# Altium schematic sheet FPGA_Bank_0_CFG.SchDoc: Sayma AMC
size 420 x 297 mm; $$Internal___BlkDate: 0:12:25_2-9-18; $$Internal_NAME_PLACEHOLDER: a3sheet; $$Internal_Resolution: 00001mm; $$NotCommonProperty_@NAME: FPGA_XCKU040FFVA1156; $$NotCommonProperty_@PRINTORDER: 15; $$NotCommonProperty_@SHEET: FPGA Bank 0 CFG; $$NotCommonProperty_@SHEETTOTAL: 30; CmpIndex: 969; Drawing Author: G.Kasprowicz; Drawing Number: Sayma AMC; Drawing Project: AMC FMC Carrier Board; Drawing Revision: 2.0; SymIndex: 2141; CheckedBy: P.Kulik,T.Przywozki,W.Ruclo; Author: G.Kasprowicz; CompanyName: WUT ISE; DrawnBy: G.Kasprowicz; Organization: WUT ISE; Address1: PW ISE; Address2: Nowowiejska 15/19 00-665 Warsaw; Address3: gkasprow@gmail.com; DocumentNumber: 21; Revision: 2; SheetNumber: 21; SheetTotal: 32; ModifiedBy: -; CheckedDate: -; Title2: FPGA config; DivGrp: WUT ISE; Designer: G.Kasprowicz; ModifiedDate: -; ProjectName: Sensor Box
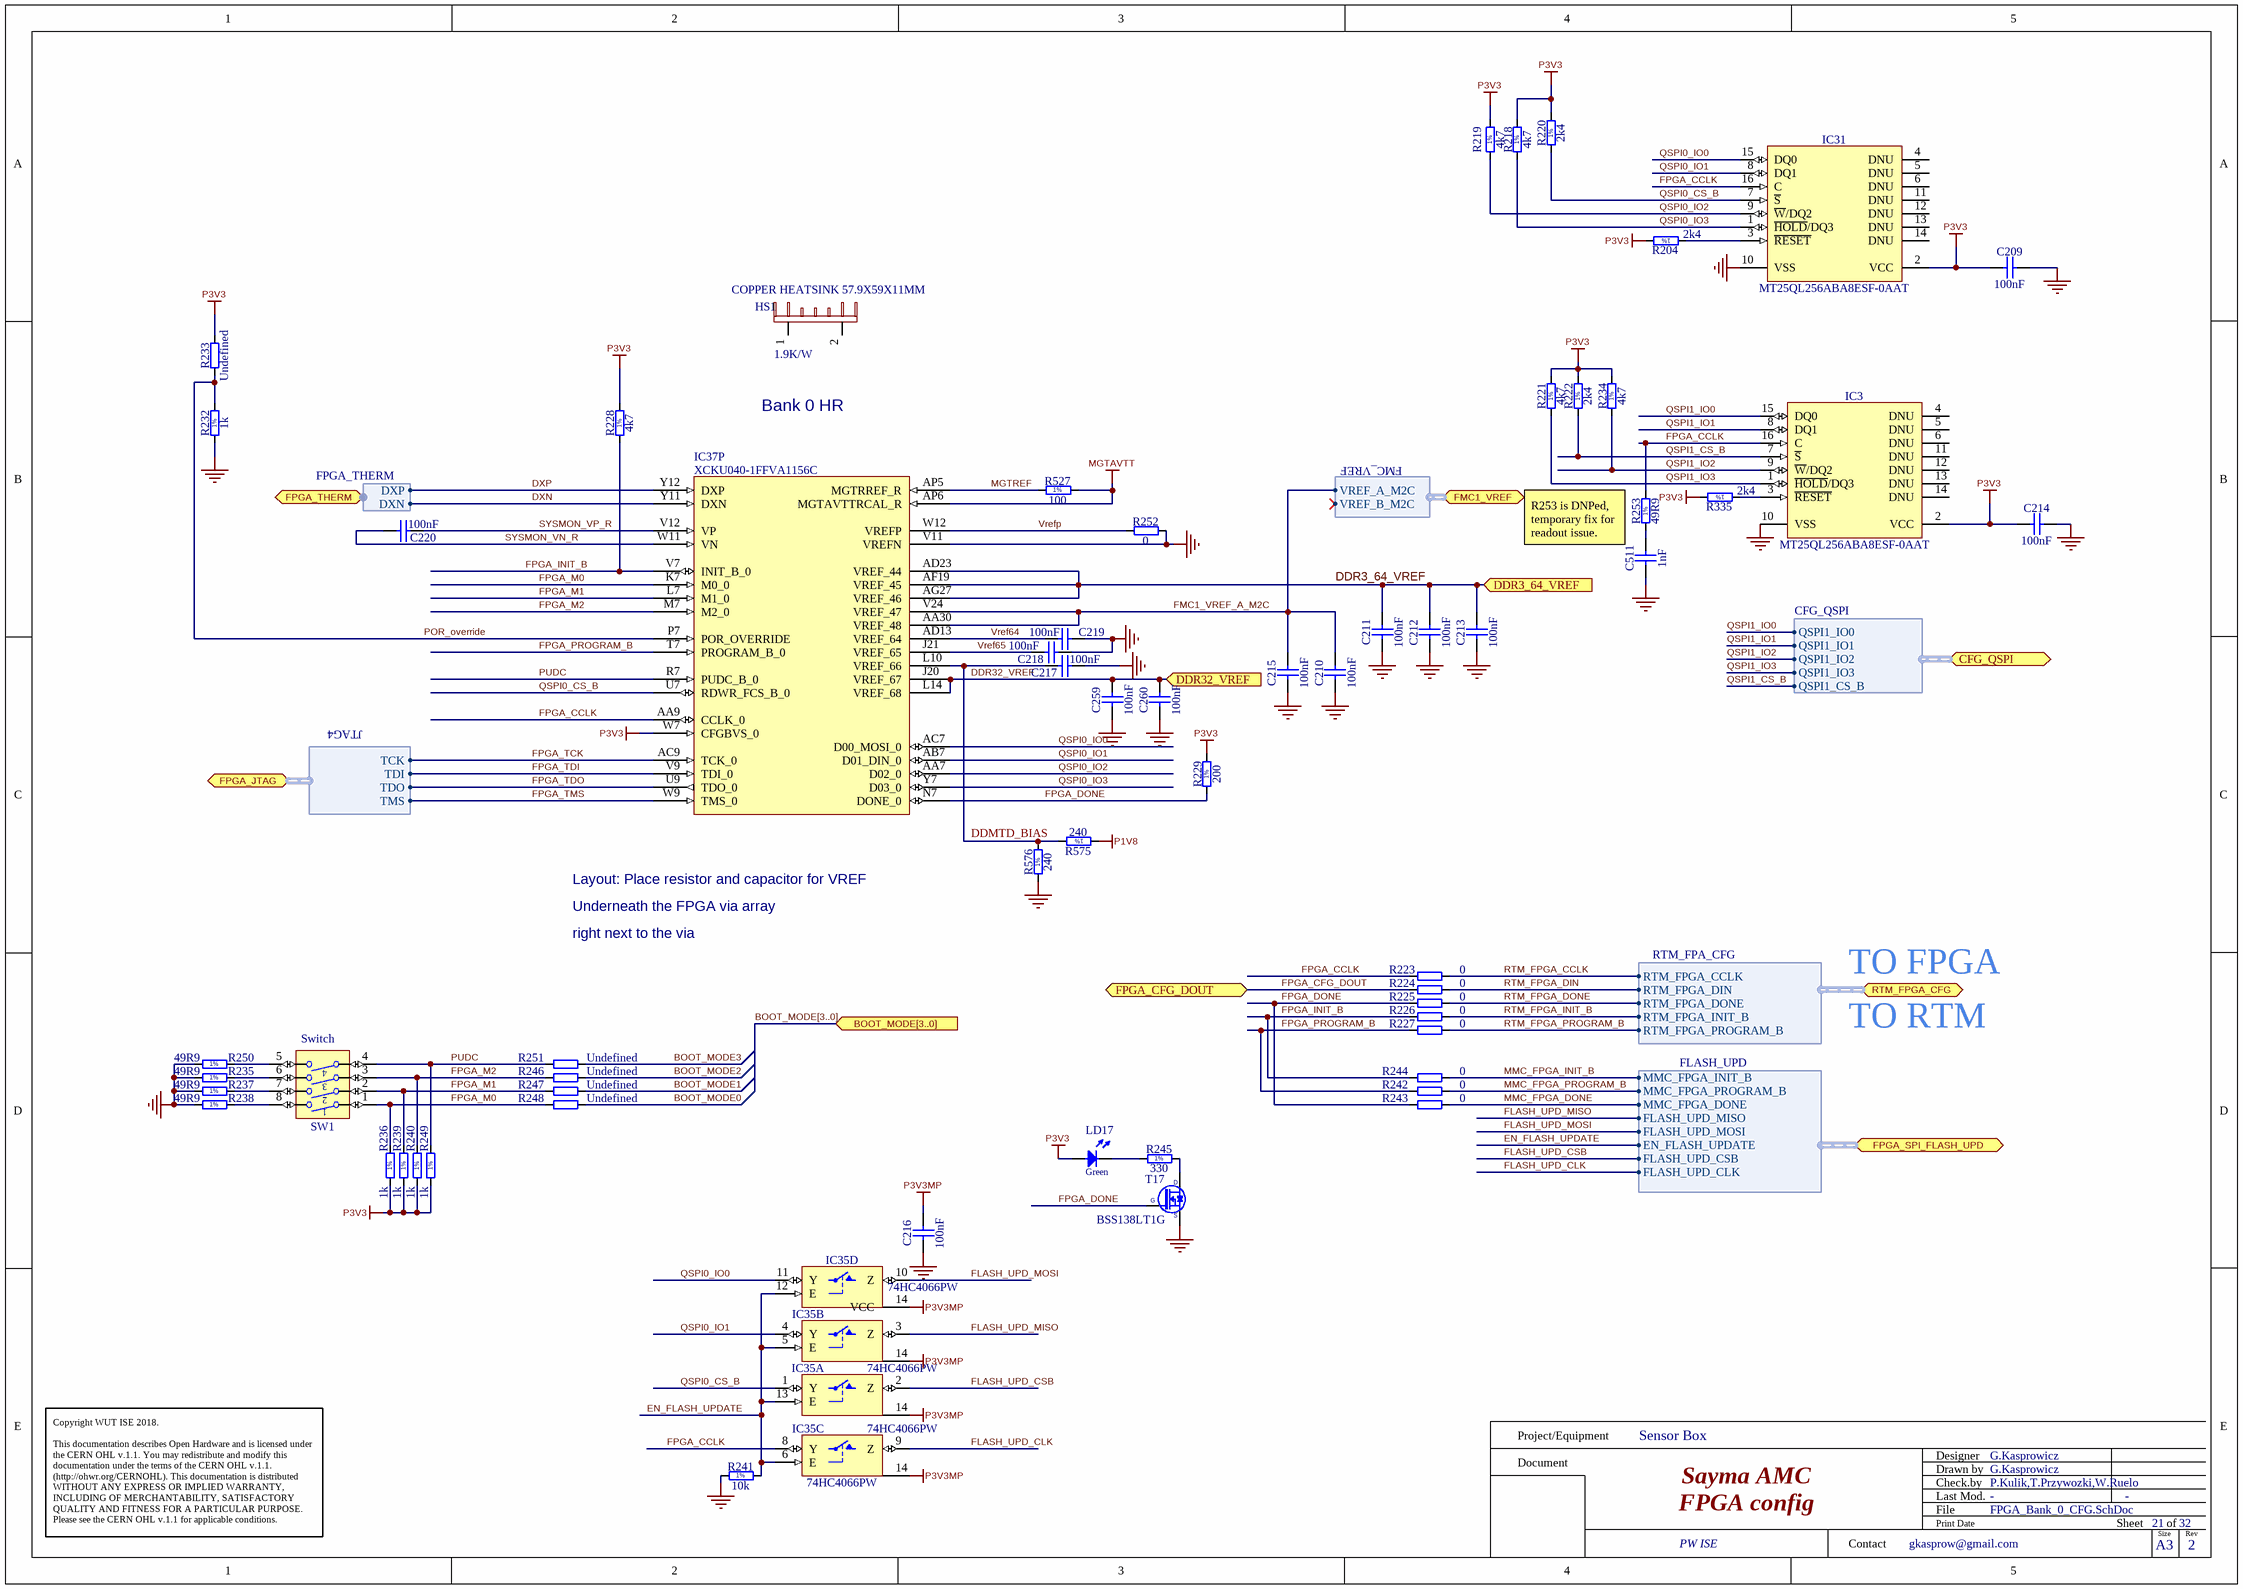
[diagram p0: FPGA_Bank_0_CFG.SchDoc]

## Parts
C209  100nF  [CAPC0603X33N]
C210  100nF  [CAPC0603X33N]
C211  100nF  [CAPC0603X33N]
C212  100nF  [CAPC0603X33N]
C213  100nF  [CAPC0603X33N]
C214  100nF  [CAPC0603X33N]
C215  100nF  [CAPC0603X33N]
C216  100nF  [CAPC0603X33N]
C217  100nF  [CAPC0603X33N]
C218  100nF  [CAPC0603X33N]
C219  100nF  [CAPC0603X33N]
C220  100nF  [CAPC0603X33N]
C259  100nF  [CAPC0603X33N]
C260  100nF  [CAPC0603X33N]
C511  1nF  [CAPC1005X55N]
HS1  1.9K/W  Part Description: COPPER HEATSINK 57.9X59X11MM  [HS_AAVID_342947]
IC3  MT25QL256ABA8ESF-0AAT  [SOIC127P1030X265-16N]
IC31  MT25QL256ABA8ESF-0AAT  [SOIC127P1030X265-16N]
IC35  74HC4066PW  [SOP65P640X110-14N]  (parts A,B,C,D of 4)
IC37  XCKU040-1FFVA1156C  [BGA1156C100P34X34_3500X3500X350]  (part P of 22)
LD17  Green  [LED_AVAGO_HSME-C120]
R204  2k4  [RESC1005X40N]
R218  4k7  [RESC1005X40N]
R219  4k7  [RESC1005X40N]
R220  2k4  [RESC1005X40N]
R221  4k7  [RESC1005X40N]
R222  2k4  [RESC1005X40N]
R223  0  [RESC1005X40N]
R224  0  [RESC1005X40N]
R225  0  [RESC1005X40N]
R226  0  [RESC1005X40N]
R227  0  [RESC1005X40N]
R228  4k7  [RESC1005X40N]
R229  200  [RESC1005X40N]
R232  1k  [RESC1005X40N]
R233  Undefined  [RESC1005X40N]
R234  4k7  [RESC1005X40N]
R235  49R9  [RESC1005X40N]
R236  1k  [RESC1005X40N]
R237  49R9  [RESC1005X40N]
R238  49R9  [RESC1005X40N]
R239  1k  [RESC1005X40N]
R240  1k  [RESC1005X40N]
R241  10k  [RESC1005X40N]
R242  0  [RESC1005X40N]
R243  0  [RESC1005X40N]
R244  0  [RESC1005X40N]
R245  330  [RESC1005X40N]
R246  Undefined  [RESC1005X40N]
R247  Undefined  [RESC1005X40N]
R248  Undefined  [RESC1005X40N]
R249  1k  [RESC1005X40N]
R250  49R9  [RESC1005X40N]
R251  Undefined  [RESC1005X40N]
R252  0  [RESC1005X40N]
R253  49R9  [RESC1005X40N]
R335  2k4  [RESC1005X40N]
R527  100  [RESC0603X28N]
R575  240  [RESC1005X40N]
R576  240  [RESC1005X40N]
SW1  Switch  [SW_TYCO_1571983-4]
T17  BSS138LT1G  [SOT95P240X110-3N]

## Ports
BOOT_MODE[3..0] (in), CFG_QSPI (bidir, harness CFG_QSPI), DDR3_64_VREF (in), DDR32_VREF (in), FMC1_VREF (bidir, harness FMC_VREF), FPGA_CFG_DOUT (bidir), FPGA_JTAG (bidir, harness JTAG4), FPGA_SPI_FLASH_UPD (bidir, harness FLASH_UPD), FPGA_THERM (bidir, harness FPGA_THERM), RTM_FPGA_CFG (bidir, harness RTM_FPA_CFG)

## Harnesses
CFG_QSPI: QSPI1_IO0, QSPI1_IO1, QSPI1_IO2, QSPI1_IO3, QSPI1_CS_B
FLASH_UPD: MMC_FPGA_PROGRAM_B, MMC_FPGA_DONE, EN_FLASH_UPDATE, MMC_FPGA_INIT_B, FLASH_UPD_CLK, FLASH_UPD_CSB, FLASH_UPD_MISO, FLASH_UPD_MOSI
FMC_VREF: VREF_A_M2C, VREF_B_M2C
RTM_FPA_CFG: RTM_FPGA_DIN, RTM_FPGA_CCLK, RTM_FPGA_PROGRAM_B, RTM_FPGA_DONE, RTM_FPGA_INIT_B
JTAG4: TCK, TDI, TDO, TMS
FPGA_THERM: DXP, DXN

## Nets
GND: C209.1 C210.2 C211.2 C212.2 C213.2 C214.1 C215.2 C216.1 C217.2 C218.2 C219.2 C259.2 C260.2 C511.1 IC3.10(VSS) IC31.10(VSS) IC35.7(GND) IC37.V11(VREFN) R232.1 R235.1 R237.1 R238.1 R241.1 R250.1 R252.2 R576.1 T17.2(S)
MGTAVTT: IC37.AP6(MGTAVTTRCAL_R) R527.2
P1V8: R575.1
P3V3: C209.2 C214.2 IC3.2(VCC) IC31.2(VCC) IC37.W7(CFGBVS_0) LD17.2(A) R204.2 R218.2 R219.2 R220.2 R221.2 R222.2 R228.2 R229.2 R233.2 R234.2 R236.1 R239.1 R240.1 R249.1 R335.2
P3V3MP: C216.2 IC35.14(VCC)
BOOT_MODE0: R248.2
BOOT_MODE1: R247.2
BOOT_MODE2: R246.2
BOOT_MODE3: R251.2
DDMTD_BIAS: C217.1 IC37.L10(VREF_66) R575.2 R576.2
DDR3_64_VREF: C211.1 C212.1 C213.1 IC37.AD23(VREF_44) IC37.AF19(VREF_45) IC37.AG27(VREF_46) ; port DDR3_64_VREF
DDR32_VREF: C259.1 C260.1 IC37.J20(VREF_67) IC37.L14(VREF_68) ; port DDR32_VREF
DXN: IC37.Y11(DXN) ; port FPGA_THERM.DXN
DXP: IC37.Y12(DXP) ; port FPGA_THERM.DXP
EN_FLASH_UPDATE: IC35.5(E) IC35.6(E) IC35.12(E) IC35.13(E) R241.2 ; port FPGA_SPI_FLASH_UPD.EN_FLASH_UPDATE
FLASH_UPD_CLK: IC35.9(Z) ; port FPGA_SPI_FLASH_UPD.FLASH_UPD_CLK
FLASH_UPD_CSB: IC35.2(Z) ; port FPGA_SPI_FLASH_UPD.FLASH_UPD_CSB
FLASH_UPD_MISO: IC35.3(Z) ; port FPGA_SPI_FLASH_UPD.FLASH_UPD_MISO
FLASH_UPD_MOSI: IC35.10(Z) ; port FPGA_SPI_FLASH_UPD.FLASH_UPD_MOSI
FMC1_VREF_A_M2C: C210.1 C215.1 IC37.AA30(VREF_48) IC37.V24(VREF_47) ; port FMC1_VREF.VREF_A_M2C
FPGA_CCLK: IC3.16(C) IC31.16(C) IC35.8(Y) IC37.AA9(CCLK_0) R223.1 R253.2
FPGA_CFG_DOUT: R224.1 ; port FPGA_CFG_DOUT
FPGA_DONE: IC37.N7(DONE_0) R225.1 R229.1 R243.1 T17.1(G)
FPGA_INIT_B: IC37.V7(INIT_B_0) R226.1 R228.1 R244.1
FPGA_M0: IC37.K7(M0_0) R236.2 R248.1 SW1.1
FPGA_M1: IC37.L7(M1_0) R239.2 R247.1 SW1.2
FPGA_M2: IC37.M7(M2_0) R240.2 R246.1 SW1.3
FPGA_PROGRAM_B: IC37.T7(PROGRAM_B_0) R227.1 R242.1
FPGA_TCK: IC37.AC9(TCK_0) ; port FPGA_JTAG.TCK
FPGA_TDI: IC37.V9(TDI_0) ; port FPGA_JTAG.TDI
FPGA_TDO: IC37.U9(TDO_0) ; port FPGA_JTAG.TDO
FPGA_TMS: IC37.W9(TMS_0) ; port FPGA_JTAG.TMS
MGTREF: IC37.AP5(MGTRREF_R) R527.1
MMC_FPGA_DONE: R243.2 ; port FPGA_SPI_FLASH_UPD.MMC_FPGA_DONE
MMC_FPGA_INIT_B: R244.2 ; port FPGA_SPI_FLASH_UPD.MMC_FPGA_INIT_B
MMC_FPGA_PROGRAM_B: R242.2 ; port FPGA_SPI_FLASH_UPD.MMC_FPGA_PROGRAM_B
POR_override: IC37.P7(POR_OVERRIDE) R232.2 R233.1
PUDC: IC37.R7(PUDC_B_0) R249.2 R251.1 SW1.4
QSPI0_CS_B: IC31.7(~{S}) IC35.1(Y) IC37.U7(RDWR_FCS_B_0) R220.1
QSPI0_IO0: IC31.15(DQ0) IC35.11(Y) IC37.AC7(D00_MOSI_0)
QSPI0_IO1: IC31.8(DQ1) IC35.4(Y) IC37.AB7(D01_DIN_0)
QSPI0_IO2: IC31.9(~{W}/DQ2) IC37.AA7(D02_0) R219.1
QSPI0_IO3: IC31.1(~{HOLD}/DQ3) IC37.Y7(D03_0) R218.1
QSPI1_CS_B: IC3.7(~{S}) R222.1 ; port CFG_QSPI.QSPI1_CS_B
QSPI1_IO0: IC3.15(DQ0) ; port CFG_QSPI.QSPI1_IO0
QSPI1_IO1: IC3.8(DQ1) ; port CFG_QSPI.QSPI1_IO1
QSPI1_IO2: IC3.9(~{W}/DQ2) R234.1 ; port CFG_QSPI.QSPI1_IO2
QSPI1_IO3: IC3.1(~{HOLD}/DQ3) R221.1 ; port CFG_QSPI.QSPI1_IO3
RTM_FPGA_CCLK: R223.2 ; port RTM_FPGA_CFG.RTM_FPGA_CCLK
RTM_FPGA_DIN: R224.2 ; port RTM_FPGA_CFG.RTM_FPGA_DIN
RTM_FPGA_DONE: R225.2 ; port RTM_FPGA_CFG.RTM_FPGA_DONE
RTM_FPGA_INIT_B: R226.2 ; port RTM_FPGA_CFG.RTM_FPGA_INIT_B
RTM_FPGA_PROGRAM_B: R227.2 ; port RTM_FPGA_CFG.RTM_FPGA_PROGRAM_B
SYSMON_VN_R: C220.1 IC37.W11(VN)
SYSMON_VP_R: C220.2 IC37.V12(VP)
Vref64: C219.1 IC37.AD13(VREF_64)
Vref65: C218.1 IC37.J21(VREF_65)
Vrefp: IC37.W12(VREFP) R252.1
NetC511_2: C511.2 R253.1
NetIC3_3: IC3.3(~{RESET}) R335.1
NetIC31_3: IC31.3(~{RESET}) R204.1
NetLD17_1: LD17.1(C) R245.1
NetR235_2: R235.2 SW1.6
NetR237_2: R237.2 SW1.7
NetR238_2: R238.2 SW1.8
NetR245_2: R245.2 T17.3(D)
NetR250_2: R250.2 SW1.5

Not connected (* = marked no-connect by the designer): HS1 1(MOUNT1) 2(MOUNT2); IC3 4(DNU) 5(DNU) 6(DNU) 11(DNU) 12(DNU) 13(DNU) 14(DNU); IC31 4(DNU) 5(DNU) 6(DNU) 11(DNU) 12(DNU) 13(DNU) 14(DNU)

## Buses and harness runs
bus BOOT_MODE[3..0] = port BOOT_MODE[3..0]

## Notes on the sheet
- Bank 0 HR
- R253 is DNPed, temporary fix for readout issue.
- Layout: Place resistor and capacitor for VREF
- right next to the via
- Underneath the FPGA via array
- TO FPGA
- TO RTM
- Project/Equipment
- Document
- Designer
- Drawn by
- Check.by
- Copyright WUT ISE 2018.
  This documentation describes Open Hardware and is licensed under the CERN OHL v.1.1. You may redistribute and modify this documentation under the terms of the CERN OHL v.1.1. (http://ohwr.org/CERNOHL). This documentation is distributed WITHOUT ANY EXPRESS OR IMPLIED WARRANTY, INCLUDING OF MERCHANTABILITY, SATISFACTORY QUALITY AND FITNESS FOR A PARTICULAR PURPOSE. Please see the CERN OHL v.1.1 for applicable conditions.
- Contact
- File
- Last Mod.
- Print Date
- Sheet
- Size
- A3
- of
- Rev
- (in symbol R0201_100R_1%_0.05W_200PPM) 1%
- (in symbol R0402_1K_1%_0.0625W_100PPM) 1%
- (in symbol R0402_2K4_1%_0.0625W_100PPM) 1%
- (in symbol R0402_4K7_1%_0.0625W_100PPM) 1%
- (in symbol R0402_4k7_1%_0.0625W_100PPM) 1%
- (in symbol R0402_10K_1%_0.0625W_100PPM) 1%
- (in symbol R0402_49R9_1%_0.0625W_100PPM) 1%
- (in symbol R0402_200R_1%_0.0625W_100PPM) 1%
- (in symbol R0402_240R_1%_0.0625W_100PPM) 1%
- (in symbol R0402_330R_1%_0.0625W_100PPM) 1%

## Library data of the parts
C209-C220 C259 C260 = CC0201_100NF_6.3V_10%_X5R: Non-polarised capacitor; Manufacturer: GENERIC; Part Description: SMD Multilayer Chip Ceramic Capacitor; Manufacturer1 Part Number: 02016D104KAT2A; Tolerance: ±10%; Voltage: 6.3V; TC: X5R; Manufacturer Part Number: CC0201_100NF_6.3V_10%_X5R; Part Number: CC0201_100NF_6.3V_10%_X5R; Value: 100nF; Component Kind: Standard; Component Type: Standard; Pin Count: 2; Status: Not Recommended; Case: 0201; Mounted: Yes; Socket: No; SMD: Yes; Sense: No; Manufacturer1 Example: AVX; Manufacturer1 ComponentHeight: 0.33mm; HelpURL: \\cern.ch\dfs\Applications\Altium\Datasheets\CC0201_X5R_AVX.pdf; Author: CERN DEM JLC; CreateDate: 03.12.2007; LatestRevisionDate: 03.12.2007
C511 = CC0402_1NF_50V_10%_X7R: Non-polarised capacitor; Manufacturer: GENERIC; Part Description: SMD Multilayer Chip Ceramic Capacitor; Manufacturer1 Part Number: 223858715623; Tolerance: ±10%; Voltage: 50V; TC: X7R; Manufacturer Part Number: CC0402_1NF_50V_10%_X7R; Part Number: CC0402_1NF_50V_10%_X7R; Value: 1nF; Component Kind: Standard; Component Type: Standard; Pin Count: 2; Status: Not Recommended; Case: 0402; Mounted: Yes; Socket: No; SMD: Yes; Sense: No; Manufacturer1 Example: PHYCOMP; Manufacturer1 ComponentHeight: 0.55mm; HelpURL: \\cern.ch\dfs\Applications\Altium\Datasheets\CC0402_X7R_PHYCOMP.pdf; Author: CERN DEM JLC; CreateDate: 03.12.2007; LatestRevisionDate: 03.12.2007
HS1 = HS_AAVID_342947: Manufacturer: Aavid Thermalloy; Part Name: HSINK_AAVID_342947; $$Internal_Resolution: 00001mm; $$NotCommonProperty_Device: 342947; CmpIndex: 1139; DXDB_LIBNAME: MISC_GK; Ref Designator: HS1; SymIndex: 1784; $$Internal___BlkDate: 23:37:56_12-26-16; Cell Name: HS_AAVID_342947; Manufacturer Part Number: 342947; Part Number: HSINK_AAVID_342947; Value: 1.9K/W; Orientation: 0 = 0
IC3 IC31 = MT25QL256ABA8ESF-0AAT: 256Mbit (32MB), 2.7V-3.6V, Multiple I/O Serial NOR Flash Memory,with Reset# & Hold#; Part Description: 256Mbit (32MB), 2.7V-3.6V, Multiple I/O Serial NOR Flash Memory,with Reset# & Hold# (Automotive grade AEC-Q100); Manufacturer: MICRON TECHNOLOGY; PressFit: No; Bonding: No; Part Number: MT25QL256ABA8ESF-0AAT; Component Kind: Standard; Component Type: Standard; Device: MT25QL256ABA8ESF-0AAT; PackageDescription: SOIC 16, Pitch 1.27mm - Body 7.5x10.3mm, IPC Medium Density; Manufacturer Part Number: MT25QL256ABA8ESF-0AAT; Pin Count: 16; Case: SOIC16; Mounted: Yes; Socket: No; SMD: Yes; Sense: No; ComponentHeight: 2.65mm; HelpURL: \\cern.ch\dfs\Applications\Altium\Datasheets\MT25QL256ABA8ESF-0AAT.pdf; Author: CERN DEM JLC; CreateDate: 05.11.2018; LatestRevisionDate: 05.11.2018
IC35 = 74HC4066PW: Manufacturer: NXP SEMICONDUCTORS; Part Description: Quad Single-Pole Single-Throw Analog Switch; PressFit: No; Bonding: No; Manufacturer Part Number: 74HC4066PW; PackageDescription: SOP, 14-Leads, Body 4.4x5mm (max), Pitch 0.65mm, IPC Medium Density; Part Number: 74HC4066PW; Component Kind: Standard; Component Type: Standard; Device: 74HC4066PW; Pin Count: 14; Case: TSSOP14; Mounted: Yes; Socket: No; SMD: Yes; Sense: No; ComponentHeight: 1.1mm; Author: CERN DEM JLC; HelpURL: \\cern.ch\dfs\Applications\Altium\Datasheets\74HC4066PW.pdf; CreateDate: 19.11.2014; LatestRevisionDate: 19.11.2014
IC37 = XCKU040-1FFVA1156C: Kintex UltraScale FPGA, 520 I/O, 530K Cells, 1156-Ball BGA, Speed Grade 1, Commercial Grade; Manufacturer: XILINX; Part Description: Kintex UltraScale, 40 DLL I/O, 416 HP I/O, 104 HR I/O, 1156-Pin BGA, Speed Grade 1, Commercial Grade; PressFit: No; Bonding: No; PackageDescription: BGA, 1.00mm Pitch, Square; 1156 Pin, 34 Columns X 34 Rows, Body 35.00mm X 35.00mm X 3.50mm H, IPC Medium Density; Part Number: XCKU040-1FFVA1156C; Component Kind: Standard; Component Type: Standard; Device: XCKU040-1FFVA1156C; Manufacturer Part Number: XCKU040-1FFVA1156C; Pin Count: 1156; Case: BGA1156; Mounted: Yes; Socket: No; SMD: Yes; Sense: No; ComponentHeight: 3.5mm; HelpURL: \\cern.ch\dfs\Applications\Altium\Datasheets\XCKU040-1FFVA1156C.pdf; ComponentLink1URL: \\cern.ch\dfs\Applications\Altium\Datasheets\XCKU040-1FFVA1156C_Package-Pinout.pdf; ComponentLink1Description: Package/Pinout; Author: CERN DEM CA; CreateDate: 16.08.2016; LatestRevisionDate: 16.08.2016
LD17 = LED_AVAGO_HSME-C120: LED Green 1C 2A; Manufacturer: AVAGO TECHNOLOGIES; Part Description: High Performance Right Angle Chip Green LED; PressFit: No; Bonding: No; Manufacturer Part Number: HSME-C120; PackageDescription: Green Chip LED, 2-Leads, Body 1.7x1.1mm, Side Emitting Package; Part Number: LED_AVAGO_HSME-C120; Component Kind: Standard; Component Type: Standard; Color: Green; Pin Count: 2; Mounted: Yes; Socket: No; SMD: Yes; Sense: No; ComponentHeight: 0.7mm; HelpURL: \\cern.ch\dfs\Applications\Altium\Datasheets\LED_AVAGO_HSME-C120.pdf; ComponentLink1URL: \\cern.ch\dfs\Applications\Altium\Datasheets\LED_AVAGO_HSME-C110_DESIGN-GUIDE.pdf; ComponentLink1Description: Design Guide; Author: CERN DEM JMW; CreateDate: 22.07.2009; LatestRevisionDate: 20.06.2012
R204 R220 R222 R335 = R0402_2K4_1%_0.0625W_100PPM: Resistor - 1%; Manufacturer: GENERIC; Part Description: General Purpose Thick Film Chip Resistor; Manufacturer1 Part Number: 232270672402L; TC: ±100ppm/°C; PressFit: No; Manufacturer Part Number: R0402_2K4_1%_0.0625W_100PPM; Part Number: R0402_2K4_1%_0.0625W_100PPM; Tolerance: ±1%; Value: 2k4; Component Kind: Standard; Component Type: Standard; Pin Count: 2; Status: Not Recommended; Power: 0.0625W; Case: 0402; Mounted: Yes; Sense: No; Socket: No; SMD: Yes; Manufacturer1 Example: YAGEO PHYCOMP; Manufacturer1 ComponentHeight: 0.4mm; HelpURL: \\cern.ch\dfs\Applications\Altium\Datasheets\R0402_Phycomp_RC0402.pdf; Author: CERN DEM JLC; CreateDate: 03.12.2007; LatestRevisionDate: 17.10.2012
R218 R219 R221 R234 = R0402_4K7_1%_0.0625W_100PPM: Resistor - 1%; Manufacturer: GENERIC; Part Description: General Purpose Thick Film Chip Resistor; Manufacturer1 Part Number: 232270674702L; TC: ±100ppm/°C; PressFit: No; Manufacturer Part Number: R0402_4K7_1%_0.0625W_100PPM; Part Number: R0402_4K7_1%_0.0625W_100PPM; Tolerance: ±1%; Value: 4k7; Component Kind: Standard; Component Type: Standard; Pin Count: 2; Status: Not Recommended; Power: 0.0625W; Case: 0402; Mounted: Yes; Sense: No; Socket: No; SMD: Yes; Manufacturer1 Example: YAGEO PHYCOMP; Manufacturer1 ComponentHeight: 0.4mm; HelpURL: \\cern.ch\dfs\Applications\Altium\Datasheets\R0402_Phycomp_RC0402.pdf; Author: CERN DEM JLC; CreateDate: 03.12.2007; LatestRevisionDate: 17.10.2012
R223-R227 R242-R244 R252 = R0402_0R_JUMPER: Resistor; Manufacturer: GENERIC; Part Description: 1A (0.05R Max DC Resistance) Zero Ohm Jumper; Manufacturer1 Part Number: 232270591001L; PressFit: No; Manufacturer Part Number: R0402_0R_JUMPER; Part Number: R0402_0R_JUMPER; Value: 0; Component Kind: Standard; Component Type: Standard; Pin Count: 2; Status: Not Recommended; Case: 0402; Mounted: Yes; Sense: No; Socket: No; SMD: Yes; Manufacturer1 Example: YAGEO PHYCOMP; Manufacturer1 ComponentHeight: 0.4mm; HelpURL: \\cern.ch\dfs\Applications\Altium\Datasheets\R0402_Phycomp_RC0402.pdf; Author: CERN DEM JLC; CreateDate: 03.12.2007; LatestRevisionDate: 17.10.2012
R228 = R0402_4k7_1%_0.0625W_100PPM: Resistor - 1%; Manufacturer: GENERIC; Part Description: General Purpose Thick Film Chip Resistor; Manufacturer1 Part Number: 232270674702L; TC: ±100ppm/°C; PressFit: No; Manufacturer Part Number: R0402_4K7_1%_0.0625W_100PPM; Part Number: R0402_4K7_1%_0.0625W_100PPM; Tolerance: ±1%; Value: 4k7; Component Kind: Standard; Component Type: Standard; Pin Count: 2; Status: Not Recommended; Power: 0.0625W; Case: 0402; Mounted: Yes; Sense: No; Socket: No; SMD: Yes; Manufacturer1 Example: YAGEO PHYCOMP; Manufacturer1 ComponentHeight: 0.4mm; HelpURL: \\cern.ch\dfs\Applications\Altium\Datasheets\R0402_Phycomp_RC0402.pdf; Author: CERN DEM JLC; CreateDate: 2007-12-03; LatestRevisionDate: 2012-10-17
R229 = R0402_200R_1%_0.0625W_100PPM: Resistor - 1%; Manufacturer: GENERIC; Part Description: General Purpose Thick Film Chip Resistor; Manufacturer1 Part Number: 232270672001L; TC: ±100ppm/°C; PressFit: No; Manufacturer Part Number: R0402_200R_1%_0.0625W_100PPM; Part Number: R0402_200R_1%_0.0625W_100PPM; Tolerance: ±1%; Value: 200; Component Kind: Standard; Component Type: Standard; Pin Count: 2; Status: Not Recommended; Power: 0.0625W; Case: 0402; Mounted: Yes; Sense: No; Socket: No; SMD: Yes; Manufacturer1 Example: YAGEO PHYCOMP; Manufacturer1 ComponentHeight: 0.4mm; HelpURL: \\cern.ch\dfs\Applications\Altium\Datasheets\R0402_Phycomp_RC0402.pdf; Author: CERN DEM JLC; CreateDate: 03.12.2007; LatestRevisionDate: 17.10.2012
R232 R236 R239 R240 R249 = R0402_1K_1%_0.0625W_100PPM: Resistor - 1%; Manufacturer: GENERIC; Part Description: General Purpose Thick Film Chip Resistor; Manufacturer1 Part Number: 232270671002L; TC: ±100ppm/°C; PressFit: No; Manufacturer Part Number: R0402_1K_1%_0.0625W_100PPM; Part Number: R0402_1K_1%_0.0625W_100PPM; Tolerance: ±1%; Value: 1k; Component Kind: Standard; Component Type: Standard; Pin Count: 2; Status: Not Recommended; Power: 0.0625W; Case: 0402; Mounted: Yes; Sense: No; Socket: No; SMD: Yes; Manufacturer1 Example: YAGEO PHYCOMP; Manufacturer1 ComponentHeight: 0.4mm; HelpURL: \\cern.ch\dfs\Applications\Altium\Datasheets\R0402_Phycomp_RC0402.pdf; Author: CERN DEM JLC; CreateDate: 03.12.2007; LatestRevisionDate: 17.10.2012
R233 R246-R248 R251 = R0402_NO-VALUE: Resistor; Part Description: Reserved Footprint For a 0402 (1005) Chip Resistor; PressFit: No; Mounted: No; Manufacturer Part Number: R0402_NO-VALUE; Manufacturer: Undefined; Part Number: R0402_NO-VALUE; Value: Undefined; Component Kind: Standard; Component Type: Standard; Pin Count: 2; Status: None; Case: 0402; Sense: No; Socket: No; SMD: Yes; Manufacturer1 Example: Undefined; Manufacturer1 Part Number: Undefined; Manufacturer1 ComponentHeight: Undefined; HelpURL: Undefined; Author: CERN DEM JLC; CreateDate: 03.12.2007; LatestRevisionDate: 13.03.2008
R235 R237 R238 R250 R253 = R0402_49R9_1%_0.0625W_100PPM: Resistor - 1%; Manufacturer: GENERIC; Part Description: General Purpose Thick Film Chip Resistor; Manufacturer1 Part Number: 232270674999L or RC0402FR-0749R9L; TC: ±100ppm/°C; PressFit: No; Manufacturer Part Number: R0402_49R9_1%_0.0625W_100PPM; Part Number: R0402_49R9_1%_0.0625W_100PPM; Tolerance: ±1%; Value: 49R9; Component Kind: Standard; Component Type: Standard; Pin Count: 2; Status: Not Recommended; Power: 0.0625W; Case: 0402; Mounted: Yes; Sense: No; Socket: No; SMD: Yes; Manufacturer1 Example: YAGEO PHYCOMP; Manufacturer1 ComponentHeight: 0.4mm; HelpURL: \\cern.ch\dfs\Applications\Altium\Datasheets\R0402_Phycomp_RC0402.pdf; Author: CERN DEM JLC; CreateDate: 24.10.2012; LatestRevisionDate: 24.10.2012
R241 = R0402_10K_1%_0.0625W_100PPM: Resistor - 1%; Manufacturer: GENERIC; Part Description: General Purpose Thick Film Chip Resistor; Manufacturer1 Part Number: 232270671003L; TC: ±100ppm/°C; PressFit: No; Manufacturer Part Number: R0402_10K_1%_0.0625W_100PPM; Part Number: R0402_10K_1%_0.0625W_100PPM; Tolerance: ±1%; Value: 10k; Component Kind: Standard; Component Type: Standard; Pin Count: 2; Status: Not Recommended; Power: 0.0625W; Case: 0402; Mounted: Yes; Sense: No; Socket: No; SMD: Yes; Manufacturer1 Example: YAGEO PHYCOMP; Manufacturer1 ComponentHeight: 0.4mm; HelpURL: \\cern.ch\dfs\Applications\Altium\Datasheets\R0402_Phycomp_RC0402.pdf; Author: CERN DEM JLC; CreateDate: 03.12.2007; LatestRevisionDate: 17.10.2012
R245 = R0402_330R_1%_0.0625W_100PPM: Resistor - 1%; Manufacturer: GENERIC; Part Description: General Purpose Thick Film Chip Resistor; Manufacturer1 Part Number: 232270673301L; TC: ±100ppm/°C; PressFit: No; Manufacturer Part Number: R0402_330R_1%_0.0625W_100PPM; Part Number: R0402_330R_1%_0.0625W_100PPM; Tolerance: ±1%; Value: 330; Component Kind: Standard; Component Type: Standard; Pin Count: 2; Status: Not Recommended; Power: 0.0625W; Case: 0402; Mounted: Yes; Sense: No; Socket: No; SMD: Yes; Manufacturer1 Example: YAGEO PHYCOMP; Manufacturer1 ComponentHeight: 0.4mm; HelpURL: \\cern.ch\dfs\Applications\Altium\Datasheets\R0402_Phycomp_RC0402.pdf; Author: CERN DEM JLC; CreateDate: 03.12.2007; LatestRevisionDate: 17.10.2012
R527 = R0201_100R_1%_0.05W_200PPM: Resistor - 1%; Manufacturer: GENERIC; Part Description: Thick Film Chip Resistor; Manufacturer1 Part Number: CRCW0201100RFNED; Power: 0.05W; TC: ±200ppm/°C; PressFit: No; Manufacturer Part Number: R0201_100R_1%_0.05W_200PPM; Part Number: R0201_100R_1%_0.05W_200PPM; Tolerance: ±1%; Value: 100; Component Kind: Standard; Component Type: Standard; Pin Count: 2; Status: Not Recommended; Case: 0201; Mounted: Yes; Sense: No; Socket: No; SMD: Yes; Manufacturer1 Example: VISHAY; Manufacturer1 ComponentHeight: 0.27mm; HelpURL: \\cern.ch\dfs\Applications\Altium\Datasheets\R0201_VISHAY_CRCW0201 e3.pdf; Author: CERN DEM JLC; CreateDate: 13.11.2014; LatestRevisionDate: 13.11.2014
R575 R576 = R0402_240R_1%_0.0625W_100PPM: Resistor - 1%; Manufacturer: GENERIC; Part Description: General Purpose Thick Film Chip Resistor; Manufacturer1 Part Number: 232270672401L; TC: ±100ppm/°C; PressFit: No; Manufacturer Part Number: R0402_240R_1%_0.0625W_100PPM; Part Number: R0402_240R_1%_0.0625W_100PPM; Tolerance: ±1%; Value: 240; Component Kind: Standard; Component Type: Standard; Pin Count: 2; Status: Not Recommended; Power: 0.0625W; Case: 0402; Mounted: Yes; Sense: No; Socket: No; SMD: Yes; Manufacturer1 Example: YAGEO PHYCOMP; Manufacturer1 ComponentHeight: 0.4mm; HelpURL: \\cern.ch\dfs\Applications\Altium\Datasheets\R0402_Phycomp_RC0402.pdf; Author: CERN DEM JLC; CreateDate: 03.12.2007; LatestRevisionDate: 17.10.2012
SW1 = SW_TYCO_1571983-4: 4 Ways SPST DIP Switch; Manufacturer Part Number: 1571983-4 or GDH04S04; Manufacturer: TYCO; Part Description: 4 Way SPST SMD DIP Switch, Latched, Contact Rating 0.025A 24VDC; PressFit: No; PackageDescription: Pitch 1.27mm,  Body 6.2x6.2mm, 4 Ways SPST Surface-Mount DIP Switch, TYCO GDH Series; Part Number: SW_TYCO_1571983-4; Component Kind: Standard; Component Type: Standard; Pin Count: 8; Family: Switch; Mounted: Yes; Socket: No; SMD: Yes; Sense: No; Status: None; ComponentHeight: 2.31mm; HelpURL: \\cern.ch\dfs\Applications\Altium\Datasheets\SW_TYCO_1571983-4.pdf; Author: CERN DEM JLC; CreateDate: 08.01.2009; LatestRevisionDate: 08.01.2009
T17 = BSS138LT1G: N-CHANNEL MOSFET WITH DIODE; Manufacturer: ON SEMICONDUCTOR; Part Description: 50V 200mA N-Channel Enhancement Mode Field-Effect Transistor; PressFit: No; Bonding: No; Manufacturer Part Number: BSS138LT1G; PackageDescription: SOT23 3-Leads, Pitch 0.95mm - Body 1.4x3mm, IPC Medium Density; Part Number: BSS138LT1G; Component Kind: Standard; Component Type: Standard; Device: BSS138LT1G; Pin Count: 3; Case: SOT23-3; Mounted: Yes; Socket: No; SMD: Yes; Sense: No; ComponentHeight: 1.11mm; HelpURL: \\cern.ch\dfs\Applications\Altium\Datasheets\BSS138LT1G.pdf; Author: CERN DEM JLC; CreateDate: 23.03.2009; LatestRevisionDate: 23.03.2009